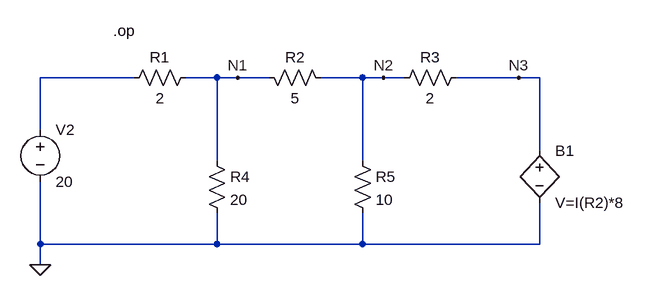
[diagram p0: schematic circuit2.asc]
circuit2.asc, the LTspice schematic file:
Version 4
SHEET 1 1372 680
WIRE 320 48 176 48
WIRE 448 48 400 48
WIRE 480 48 448 48
WIRE 528 48 480 48
WIRE 672 48 608 48
WIRE 704 48 672 48
WIRE 736 48 704 48
WIRE 912 48 816 48
WIRE 944 48 912 48
WIRE 176 128 176 48
WIRE 944 160 944 48
WIRE 448 176 448 48
WIRE 672 176 672 48
WIRE 176 304 176 208
WIRE 448 304 448 256
WIRE 448 304 176 304
WIRE 672 304 672 256
WIRE 672 304 448 304
WIRE 944 304 944 240
WIRE 944 304 672 304
WIRE 176 336 176 304
FLAG 176 336 0
FLAG 912 48 N3
FLAG 480 48 N1
FLAG 704 48 N2
SYMBOL voltage 176 112 R0
SYMATTR InstName V2
SYMATTR Value 20
SYMBOL res 416 32 R90
WINDOW 0 0 56 VBottom 2
WINDOW 3 32 56 VTop 2
SYMATTR InstName R1
SYMATTR Value 2
SYMBOL res 512 32 M90
WINDOW 0 0 56 VBottom 2
WINDOW 3 32 56 VTop 2
SYMATTR InstName R2
SYMATTR Value 5
SYMBOL res 832 32 R90
WINDOW 0 0 56 VBottom 2
WINDOW 3 32 56 VTop 2
SYMATTR InstName R3
SYMATTR Value 2
SYMBOL res 432 160 R0
SYMATTR InstName R4
SYMATTR Value 20
SYMBOL res 656 160 R0
SYMATTR InstName R5
SYMATTR Value 10
SYMBOL bv 944 144 R0
SYMATTR InstName B1
SYMATTR Value V=I(R2)*8
TEXT 288 -24 Left 2 !.op

The netlist it stands for:
* circuit2.asc
V2 N001 0 20
R1 N1 N001 2
R2 N1 N2 5
R3 N3 N2 2
R4 N1 0 20
R5 N2 0 10
B1 N3 0 V=I(R2)*8
.op
.backanno
.end